# EAGLE schematic Mainsnode_v2 (EAGLE 6.3)
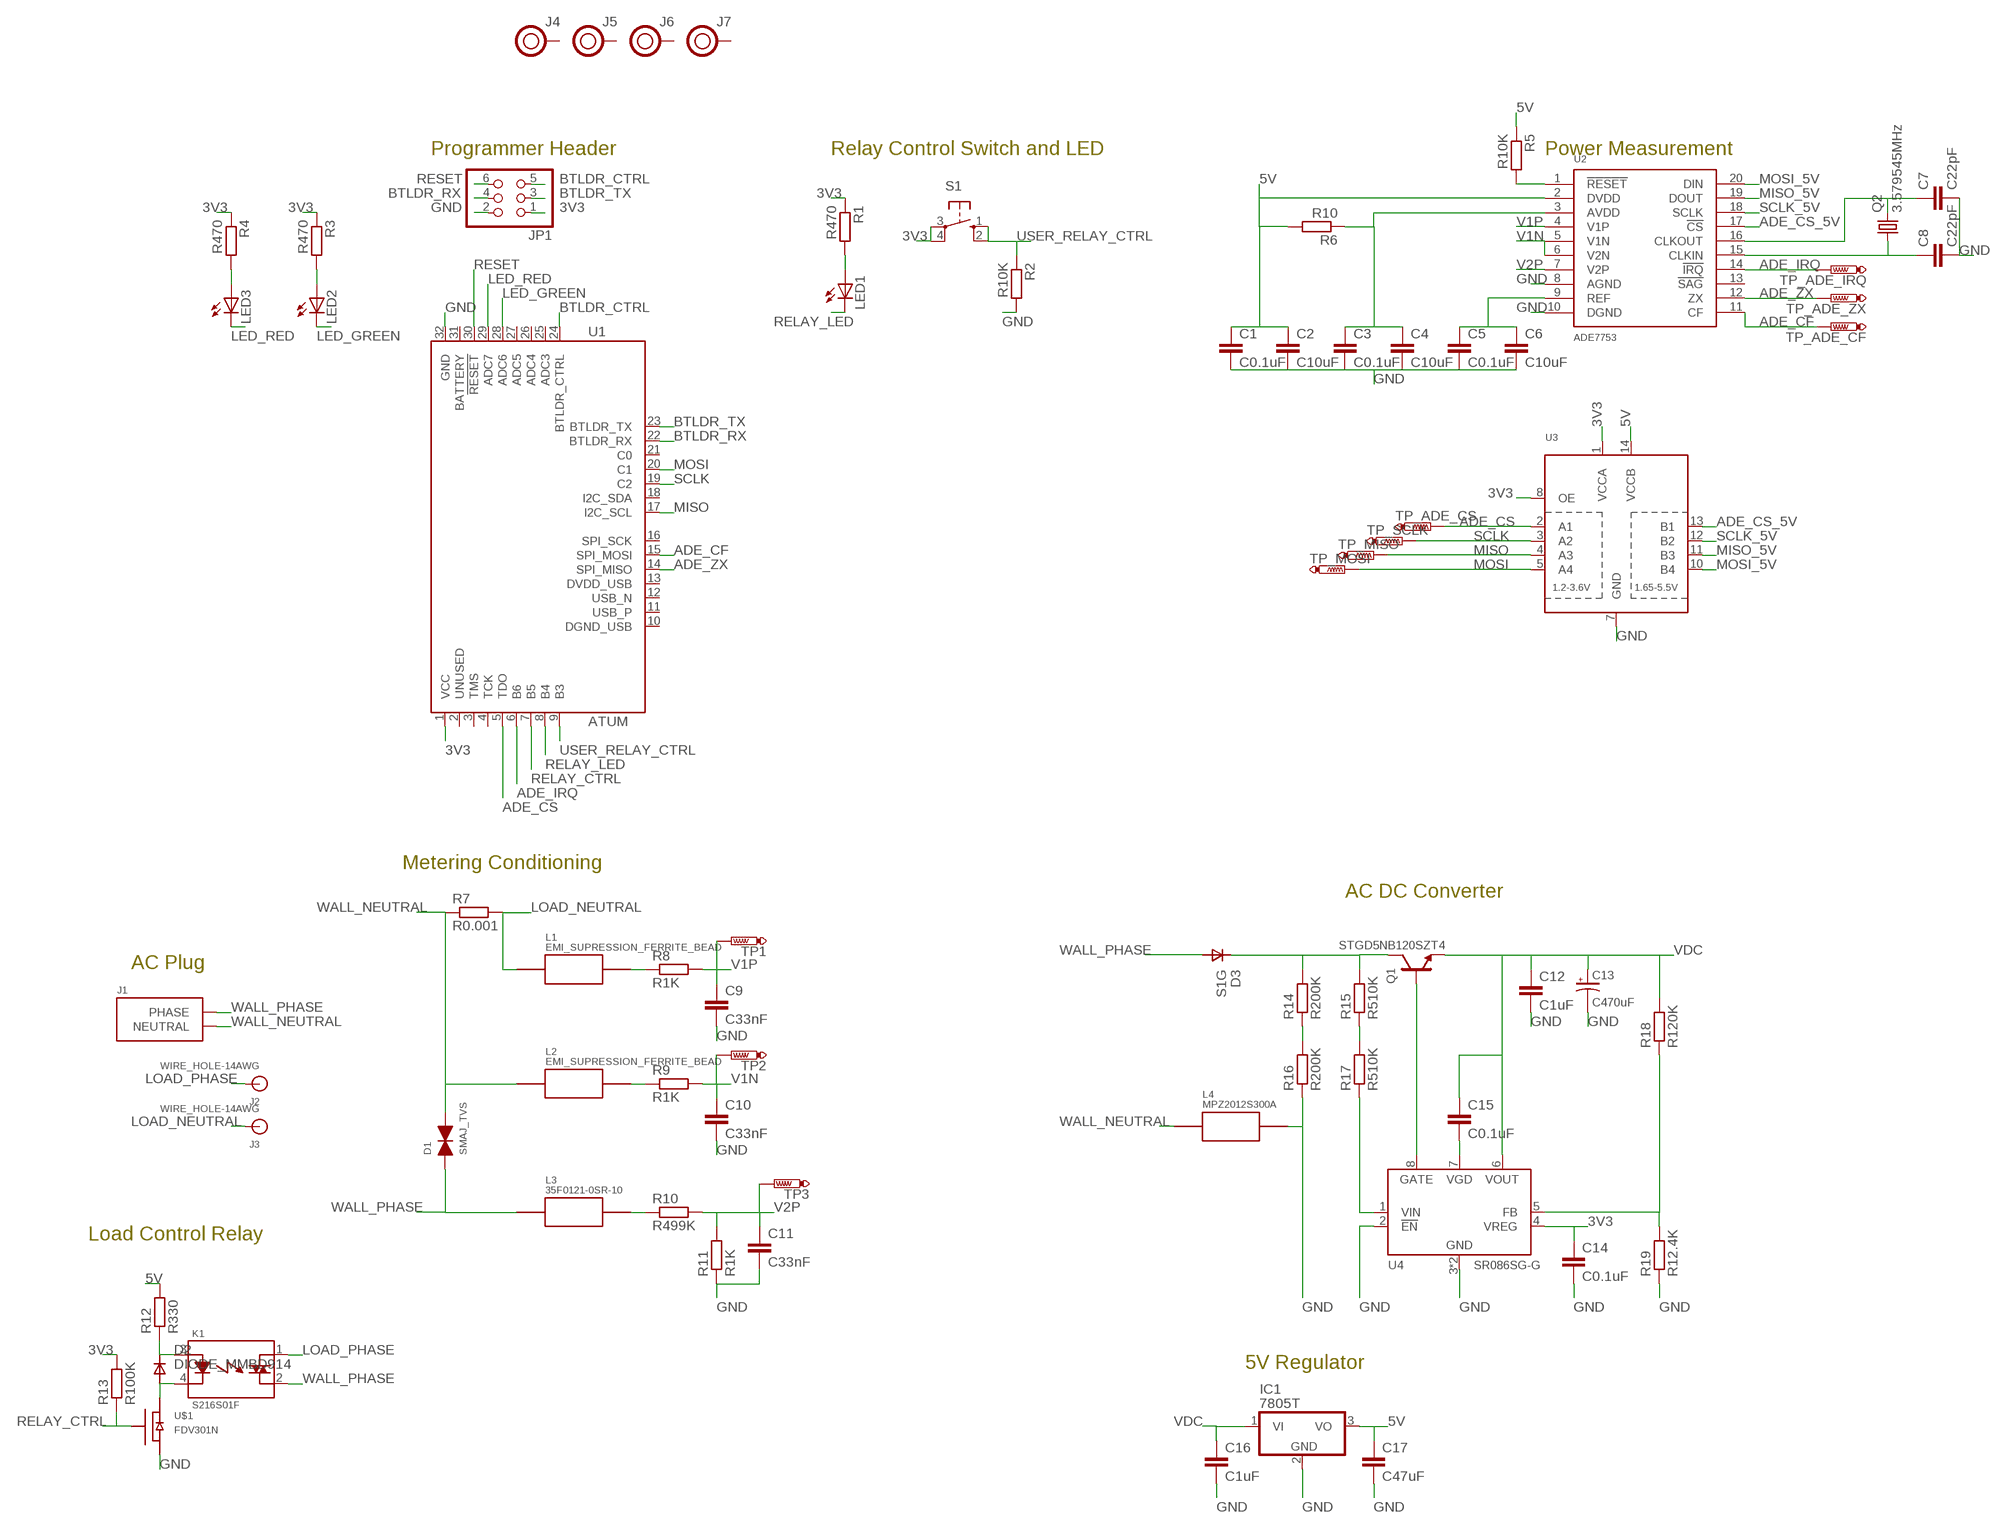
[diagram p0: schematic, sheet 1]

## Parts
C1  C0.1uF  C-EUC0805  [C0805]
C2  C10uF  C-EUC0805  [C0805]
C3  C0.1uF  C-EUC0805  [C0805]
C4  C10uF  C-EUC0805  [C0805]
C5  C0.1uF  C-EUC0805  [C0805]
C6  C10uF  C-EUC0805  [C0805]
C7  C22pF  C-EUC0805  [C0805]
C8  C22pF  C-EUC0805  [C0805]
C9  C33nF  C-EUC0805  [C0805]
C10  C33nF  C-EUC0805  [C0805]
C11  C33nF  C-EUC0805  [C0805]
C12  C1uF  C-EUC0805  [C0805]
C13  C470uF  CAP_EEE-FP1E471AP  [CAP_SM_10MM]
C14  C0.1uF  C-EUC0805  [C0805]
C15  C0.1uF  C-EUC0805  [C0805]
C16  C1uF  C-EUC0805  [C0805]
C17  C47uF  C-EUC0805  [C0805]
D1  SMAJ_TVS  [DO214_TVS]
D2  DIODE_MMBD914  [SOT-23]
D3  S1G  [DO-214AC]
IC1  7805T  [TO220H]
J1  AC-PLUG-2  [AC_MALE_PINS_2]
J2  WIRE_HOLE-14AWG  [WIRE_HOLE-14AWG]
J3  WIRE_HOLE-14AWG  [WIRE_HOLE-14AWG]
J4  HOLE  [HOLE-0.125]
J5  HOLE  [HOLE-0.125]
J6  HOLE  [HOLE-0.125]
J7  HOLE  [HOLE-0.125]
JP1  PINHD-2X3  [2X03]
K1  S216S01F  [RELAY_SX16S0X]
L1  EMI_SUPRESSION_FERRITE_BEAD  [L1806]
L2  EMI_SUPRESSION_FERRITE_BEAD  [L1806]
L3  35F0121-0SR-10  [35F0102]
L4  MPZ2012S300A  [0805_RESISTOR]
LED1  LEDCHIP-LED0805  [CHIP-LED0805]
LED2  LEDCHIP-LED0805  [CHIP-LED0805]
LED3  LEDCHIP-LED0805  [CHIP-LED0805]
Q1  STGD5NB120SZT4  [DPAK]
Q2  3.579545MHz  CRYSTALHC49S  [HC49/S]
R1  R470  R-EU_R0805  [R0805]
R2  R10K  R-EU_R0805  [R0805]
R3  R470  R-EU_R0805  [R0805]
R4  R470  R-EU_R0805  [R0805]
R5  R10K  R-EU_R0805  [R0805]
R6  R10  R-EU_R0805  [R0805]
R7  R0.001  R-EU_R2512  [R2512]
R8  R1K  R-EU_R0805  [R0805]
R9  R1K  R-EU_R0805  [R0805]
R10  R499K  R-EU_R0805  [R0805]
R11  R1K  R-EU_R0805  [R0805]
R12  R330  R-EU_R0805  [R0805]
R13  R100K  R-EU_R0805  [R0805]
R14  R200K  R-EU_R0805  [R0805]
R15  R510K  R-EU_R0805  [R0805]
R16  R200K  R-EU_R0805  [R0805]
R17  R510K  R-EU_R0805  [R0805]
R18  R120K  R-EU_R0805  [R0805]
R19  R12.4K  R-EU_R0805  [R0805]
S1  10-XX  [B3F-10XX]
TP1  PTR1PAD1-13  [P1-13]
TP2  PTR1PAD1-13  [P1-13]
TP3  PTR1PAD1-13  [P1-13]
TP_ADE_CF  PTR1PAD1-13  [P1-13]
TP_ADE_CS  PTR1PAD1-13  [P1-13]
TP_ADE_IRQ  PTR1PAD1-13  [P1-13]
TP_ADE_ZX  PTR1PAD1-13  [P1-13]
TP_MISO  PTR1PAD1-13  [P1-13]
TP_MOSI  PTR1PAD1-13  [P1-13]
TP_SCLK  PTR1PAD1-13  [P1-13]
U1  ATUM  [ATUM]
U2  ADE7753  [SSOP-20]
U3  TXB0104PWR  [TSSOP14]
U4  SR086SG-G  [SR086]
U$1  FDV301N  [SOT-23]

## Nets
3V3: C14.1 JP1.1 R1.1 R3.1 R4.1 R13.2 S1.3(P) S1.4(P1) U1.1(VCC) U3.1(VCCA) U3.8(OE) U4.4(VREG)
5V: C1.1 C2.1 C17.1 IC1.3(VO) R5.1 R6.2 R12.2 U2.2(DVDD) U3.14(VCCB)
ADE_CF: TP_ADE_CF.TP U1.15(SPI_MOSI) U2.11(CF)
ADE_CS: TP_ADE_CS.TP U1.5(TDO) U3.2(A1)
ADE_CS_5V: U2.17(!CS) U3.13(B1)
ADE_IRQ: TP_ADE_IRQ.TP U1.6(B6) U2.14(!IRQ)
ADE_ZX: TP_ADE_ZX.TP U1.14(SPI_MISO) U2.12(ZX)
BTLDR_CTRL: JP1.5 U1.24(BTLDR_CTRL)
BTLDR_RX: JP1.4 U1.22(BTLDR_RX)
BTLDR_TX: JP1.3 U1.23(BTLDR_TX)
GND: C1.2 C2.2 C3.2 C4.2 C5.2 C6.2 C7.2 C8.2 C9.2 C10.2 C11.2 C12.2 C13.- C14.2 C16.2 C17.2 IC1.2(GND) JP1.2 L4.P$2 R2.2 R11.1 R16.1 R19.1 U1.32(GND) U2.8(AGND) U2.10(DGND) U3.7(GND) U4.2(!EN) U4.3(GND) U4.PAD(GND) U$1.2(S)
LED_GREEN: LED2.C U1.28(ADC6)
LED_RED: LED3.C U1.29(ADC7)
LOAD_NEUTRAL: J3.P$1 L1.P$1 R7.2
LOAD_PHASE: J2.P$1 K1.1
MISO: TP_MISO.TP U1.17(I2C_SCL) U3.4(A3)
MISO_5V: U2.19(DOUT) U3.11(B3)
MOSI: TP_MOSI.TP U1.20(C1) U3.5(A4)
MOSI_5V: U2.20(DIN) U3.10(B4)
N$1: LED2.A R3.2
N$2: LED1.A R1.2
N$3: LED3.A R4.2
N$4: R5.2 U2.1(!RESET)
N$5: C3.1 C4.1 R6.1 U2.3(AVDD)
N$7: L1.P$2 R8.1
N$8: L2.P$2 R9.1
N$9: L3.2 R10.1
N$10: C5.1 C6.1 U2.9(REF)
N$11: D2.3(CATHODE) K1.3 R12.1
N$12: D2.1(ANNODE) K1.4 U$1.3(D)
N$13: D3.CATHODE Q1.P$2(C) R14.2 R15.2
N$14: R14.1 R16.2
N$15: R15.1 R17.2
N$17: R17.1 U4.1(VIN)
N$18: Q1.P$1(G) U4.8(GATE)
N$19: C7.1 Q2.2 U2.16(CLKOUT)
N$20: C8.1 Q2.1 U2.15(CLKIN)
N$21: C15.2 U4.7(VGD)
N$23: R18.1 R19.2 U4.5(FB)
RELAY_CTRL: R13.1 U1.7(B5) U$1.1(G)
RELAY_LED: LED1.C U1.8(B4)
RESET: JP1.6 U1.30(!RESET)
SCLK: TP_SCLK.TP U1.19(C2) U3.3(A2)
SCLK_5V: U2.18(SCLK) U3.12(B2)
USER_RELAY_CTRL: R2.1 S1.1(S) S1.2(S1) U1.9(B3)
V1N: C10.1 R9.2 TP2.TP U2.5(V1N) U2.6(V2N)
V1P: C9.1 R8.2 TP1.TP U2.4(V1P)
V2P: C11.1 R10.2 R11.2 TP3.TP U2.7(V2P)
VDC: C12.1 C13.+ C15.1 C16.1 IC1.1(VI) Q1.P$3(E) R18.2 U4.6(VOUT)
WALL_NEUTRAL: D1.CATHODE J1.NEUTRAL1(NEUTRAL) J1.NEUTRAL2(NEUTRAL) L2.P$1 L4.P$1 R7.1
WALL_PHASE: D1.ANODE D3.ANNODE J1.PHASE1(PHASE) J1.PHASE2(PHASE) K1.2 L3.1
Unconnected: J4.1 J5.1 J6.1 J7.1 U1.2(UNUSED) U1.3(TMS) U1.4(TCK) U1.10(DGND_USB) U1.11(USB_P) U1.12(USB_N) U1.13(DVDD_USB) U1.16(SPI_SCK) U1.18(I2C_SDA) U1.21(C0) U1.25(ADC3) U1.26(ADC4) U1.27(ADC5) U1.31(BATTERY) U2.13(!SAG)

## Notes on the sheet
- Programmer Header | Relay Control Switch and LED | Power Measurement
- Metering Conditioning
- AC DC Converter
- AC Plug
- Load Control Relay
- 5V Regulator

## Library data of the parts
C1-C12 C14-C17 = resistor:C-EU: CAPACITOR, European symbol
C13 = powercube:CAP_EEE-FP1E471AP: Surface mount low ESR cap.; DIGIKEY: PCE4440CT-ND
D1 = powercube:SMAJ_TVS; DIGIKEY: SMAJ250CALFCT-ND
D2 = powercube:DIODE_MMBD914: DIODE SML SIG 100V 0.2A SOT23-3; DIGIKEY: MMBD914FSCT-ND
D3 = powercube:S1G: Diode 400V 1A SMA; DIGIKEY: S1GFSCT-ND
IC1 = adafruit:78*: Positive VOLTAGE REGULATOR Added bigger pads to the TO-92 package
J1 = powercube:AC-PLUG-2: For use with Bud Industries Box: 377-1709-ND
J2 J3 = powercube:WIRE_HOLE-14AWG: Solder point for 14AWG wire
J4-J7 = powercube:HOLE: 0.125" PCB Hole with ring
JP1 = pinhead:PINHD-2X3: PIN HEADER
K1 = powercube:S216S01F: RELAY SSR 240VAC 16A TRIAC 4-SIP; DIGIKEY: 425-2413-5-ND; MOUSER: 852-S216S01F; NEWARK: 14N9591
L1 L2 = powercube:EMI_SUPRESSION_FERRITE_BEAD: FERRITE 300MA 150 OHM 1806 SMD; DIGIKEY: 240-2418-1-ND
L3 = powercube:35F0121-0SR-10: FERRITE 10A 42 OHMS @ 10 MHZ SMD; DIGIKEY: 240-2520-1-ND
L4 = powercube:MPZ2012S300A: FERRITE CHIP 30 OHM 6A 0805; DIGIKEY: 445-1566-1-ND
LED1-LED3 = adafruit:LED: LED OSRAM: - CHIPLED LG R971, LG N971, LY N971, LG Q971, LY Q971, LO R971, LY R971 LH N974, LH R974 LS Q976, LO Q976, LY Q976 LO Q996 - Hyper CHIPLED LW Q18S LB Q993, LB Q99A, LB R99A - SideLED LS A670, LO A670, LY A670, LG A670, LP A670 LB A673, LV A673, LT A673, LW A673 LH A674 LY A675 LS A676, LA A676, LO A676, LY A676, LW A676 LS A679, LY A679, LG A679 - Hyper Micro SIDELED® LS Y876, LA Y876, LO Y876, LY Y876 LT Y87S - SmartLED LW L88C, LW L88S LB L89C, LB L89S, LG L890 LS L89K, LO L89K, LY L89K LS L896, LA L896, LO L896, LY L896 - TOPLED LS T670, LO T670, LY T670, LG T670, LP T670 LSG T670, LSP T670, LSY T670, LOP T670, LYG T670 LG T671, LOG T671, LSG T671 LB T673, LV T673, LT T673, LW T673 LH T674 LS T676, LA T676, LO T676, LY T676, LB T676, LH T676, LSB T676, LW T676 LB T67C, LV T67C, LT T67C, LS T67K, LO T67K, LY T67K, LW E67C LS E67B, LA E67B, LO E67B, LY E67B, LB E67C, LV E67C, LT E67C LW T67C LS T679, LY T679, LG T679 LS T770, LO T770, LY T770, LG T770, LP T770 LB T773, LV T773, LT T773, LW T773 LH T774 LS E675, LA E675, LY E675, LS T675 LS T776, LA T776, LO T776, LY T776, LB T776 LHGB T686 LT T68C, LB T68C - Hyper Mini TOPLED® LB M676 - Mini TOPLED Santana® LG M470 LS M47K, LO M47K, LY M47K Source: http://www.osram.convergy.de/
Q1 = powercube:STGD5NB120SZ: 5 A - 1200 V - low drop internally clamped IGBT; DIGIKEY: 497-4352-1-ND
Q2 = crystal:CRYSTAL: CRYSTAL; OC_FARNELL: 1667008; OC_NEWARK: unknown
R1-R19 = resistor:R-EU_: RESISTOR, European symbol
S1 = switch-omron:10-XX: OMRON SWITCH; MPN: B3F-1000; OC_FARNELL: 176432; OC_NEWARK: 36M3542
TP1-TP3 TP_ADE_CF TP_ADE_CS TP_ADE_IRQ TP_ADE_ZX TP_MISO TP_MOSI TP_SCLK = testpad:PTR1: TEST PIN
U1 = atum:ATUM: Atum sensorboard prototyping module.
U2 = powercube:ADE7753: Single-Phase Multifunction Metering IC; DIGIKEY: ADE7753ARSZRLCT-ND; MOUSER: 584-ADE7753ARSZR; NEWARK: 59K0984
U3 = adafruit:TXB0104PWR: 4-Bit Bi-Directional Level Shifter 1.2V-3.6V (VCCA) to 1.65V-5.5V (VCCB) bi-directional level shifter with auto direction sensing. Max data rate - VCCA 1.8V: 20Mbps (50ns), VCCA 3.3V: 100Mbps (10ns) Digikey: 296-21929-1-ND
U4 = powercube:SR086: Adjustable Off-Line Inductorless Switching Regulator; MOUSER: 689-SR086SG-G
U$1 = powercube:FDV301N; DIGIKEY: FDV301NCT-ND